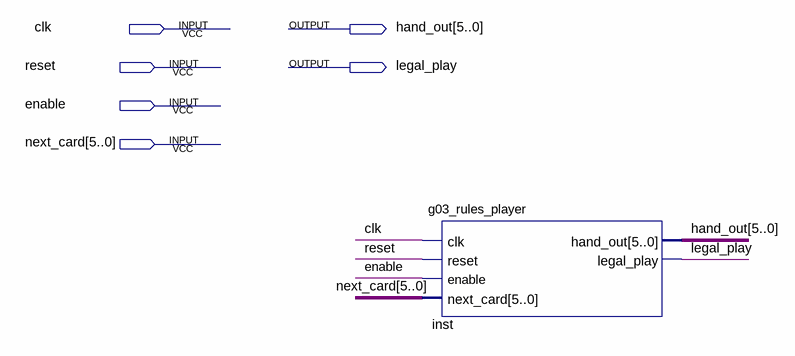
[diagram p0: schematic sheet]
// Quartus schematic g03_lab5_rules_player.bdf as structural Verilog: 1 symbols, 6 pins
module g03_lab5_rules_player (
  input  clk,
  input  reset,
  input  enable,
  input  [5:0] next_card,
  output [5:0] hand_out,
  output legal_play
);

  g03_rules_player inst (
    .clk(clk), .reset(reset), .enable(enable), .next_card(next_card), .hand_out(hand_out),
    .legal_play(legal_play));
endmodule
